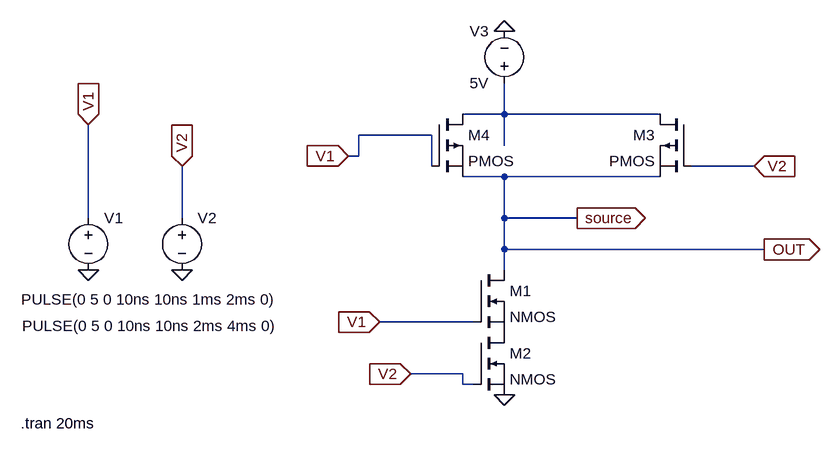
[diagram p0: schematic Draft3.asc]
Draft3.asc, the LTspice schematic file:
Version 4
SHEET 1 892 680
WIRE 384 -64 384 -112
WIRE 384 -64 320 -64
WIRE 624 -64 384 -64
WIRE 272 -32 160 -32
WIRE 384 -16 384 -64
WIRE 160 0 160 -32
WIRE 160 0 144 0
WIRE 272 16 272 -32
WIRE 768 16 672 16
WIRE 384 32 320 32
WIRE 624 32 384 32
WIRE -256 96 -256 -48
WIRE -112 96 -112 16
WIRE 384 96 384 32
WIRE 496 96 384 96
WIRE 384 144 384 96
WIRE 784 144 384 144
WIRE 384 176 384 144
WIRE 336 256 192 256
WIRE 320 336 240 336
WIRE 320 352 320 336
WIRE 336 352 320 352
FLAG 384 368 0
FLAG 384 -192 0
FLAG -112 176 0
FLAG -256 176 0
FLAG 784 144 OUT
IOPIN 784 144 Out
FLAG -256 -48 V1
IOPIN -256 -48 In
FLAG 144 0 V1
IOPIN 144 0 In
FLAG 192 256 V1
IOPIN 192 256 In
FLAG -112 16 V2
IOPIN -112 16 In
FLAG 240 336 V2
IOPIN 240 336 In
FLAG 768 16 V2
IOPIN 768 16 In
FLAG 496 96 source
IOPIN 496 96 Out
SYMBOL voltage -256 80 R0
WINDOW 3 -103 141 Left 2
WINDOW 123 0 0 Left 0
WINDOW 39 0 0 Left 0
SYMATTR InstName V1
SYMATTR Value PULSE(0 5 0 10ns 10ns 1ms 2ms 0)
SYMBOL voltage -112 80 R0
WINDOW 3 -246 182 Left 2
WINDOW 123 0 0 Left 0
WINDOW 39 0 0 Left 0
SYMATTR InstName V2
SYMATTR Value PULSE(0 5 0 10ns 10ns 2ms 4ms 0)
SYMBOL voltage 384 -96 R180
WINDOW 0 24 96 Left 2
WINDOW 3 24 16 Left 2
WINDOW 123 0 0 Left 0
WINDOW 39 0 0 Left 0
SYMATTR InstName V3
SYMATTR Value 5V
SYMBOL nmos 336 176 R0
SYMATTR InstName M1
SYMBOL nmos 336 272 R0
SYMATTR InstName M2
SYMBOL pmos 672 -64 M0
SYMATTR InstName M3
SYMBOL pmos 272 -64 R0
SYMATTR InstName M4
TEXT -360 412 Left 2 !.tran 20ms

The netlist it stands for:
* Draft3.asc
V1 V1 0 PULSE(0 5 0 10ns 10ns 1ms 2ms 0)
V2 V2 0 PULSE(0 5 0 10ns 10ns 2ms 4ms 0)
V3 N001 0 5V
M1 source V1 P001 P001 NMOS
M2 P001 V2 0 0 NMOS
M3 N001 V2 source source PMOS
M4 N001 V1 source source PMOS
.model NMOS NMOS
.model PMOS PMOS
.lib standard.mos
.tran 20ms
.backanno
.end